# Altium schematic sheet DC_DC_Power.SchDoc
size A4; SheetNumber: 1; SheetTotal: 2
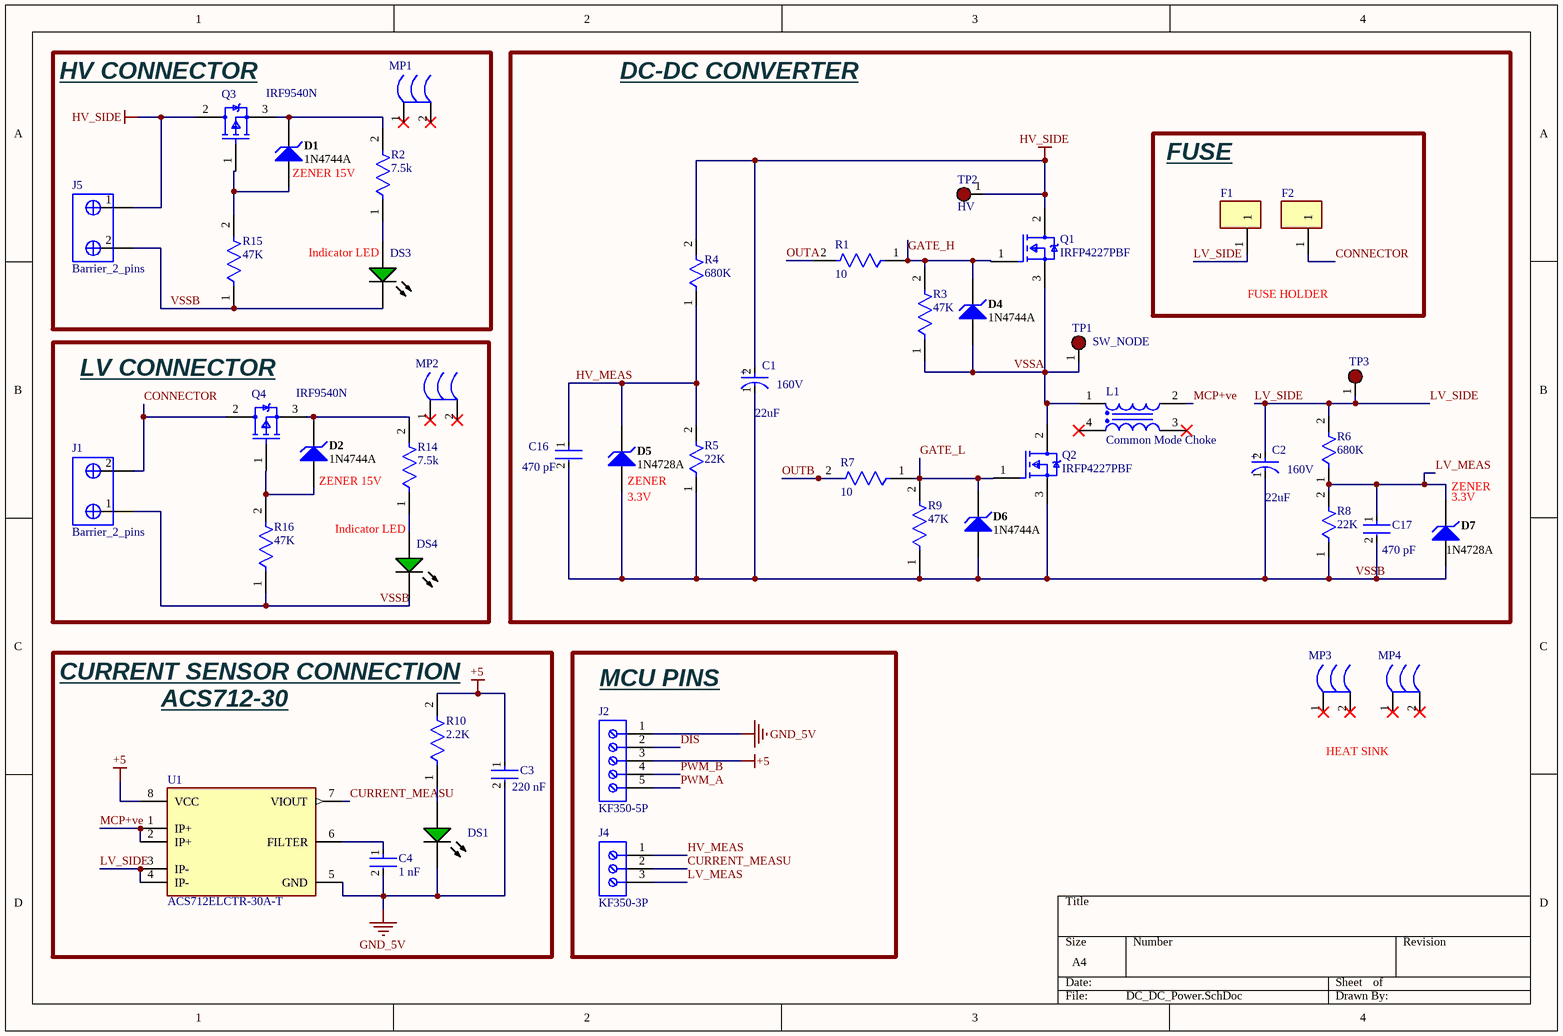
[diagram p0: DC_DC_Power.SchDoc]

## Parts
C1  22uF  [FP-RAD-TH-D_18_0_5-L_31_5-MFG]
C2  22uF  [FP-RAD-TH-D_18_0_5-L_31_5-MFG]
C3  220 nF  [FP-C0805C-DN-MFG]
C4  1 nF  [FP-C0805C-DN-MFG]
C16  470 pF  [FP-C0805C-DN-MFG]
C17  470 pF  [FP-C0805C-DN-MFG]
D1  1N4744A  [FAIR-DO-41-2_V]
D2  1N4744A  [FAIR-DO-41-2_V]
D4  1N4744A  [FAIR-DO-41-2_V]
D5  1N4728A  [FAIR-DO-41-2_V]
D6  1N4744A  [FAIR-DO-41-2_V]
D7  1N4728A  [FAIR-DO-41-2_V]
DS1  HSMG-C170  [AVAG-HSMX-C170_V]  (value not drawn)
DS3  HSMG-C170  [AVAG-HSMX-C170_V]  (value not drawn)
DS4  HSMG-C170  [AVAG-HSMX-C170_V]  (value not drawn)
F1  0751.0110  [FP-0751_0110-MFG]  (value not drawn)
F2  0751.0110  [FP-0751_0110-MFG]  (value not drawn)
J1  Barrier_2_pins  [PCBComponent_1]
J2  KF350-5P  [PCBComponent_1]
J4  KF350-3P  [PCBComponent_1]
J5  Barrier_2_pins  [PCBComponent_1]
L1  Common Mode Choke  [PCBComponent_1]
MP1  Heat Sink  [PCBComponent_1]  (value not drawn)
MP2  Heat Sink  [PCBComponent_1]  (value not drawn)
MP3  Heat Sink  [PCBComponent_1]  (value not drawn)
MP4  Heat Sink  [PCBComponent_1]  (value not drawn)
Q1  IRFP4227PBF  [FP-PG-TO247-3-MFG]
Q2  IRFP4227PBF  [FP-PG-TO247-3-MFG]
Q3  IRF9540N  [PCBComponent_1]
Q4  IRF9540N  [PCBComponent_1]
R1  10  [FP-RC0805-0_6-IPC_C]
R2  7.5k  [FP-RC0805-0_6-IPC_C]
R3  47K  [FP-RC0805-0_6-IPC_C]
R4  680K  [PCBComponent_1]
R5  22K  [PCBComponent_1]
R6  680K  [PCBComponent_1]
R7  10  [FP-RC0805-0_6-IPC_C]
R8  22K  [PCBComponent_1]
R9  47K  [FP-RC0805-0_6-IPC_C]
R10  2.2K  [FP-RC0805-0_6-IPC_C]
R14  7.5k  [FP-RC0805-0_6-IPC_C]
R15  47K  [FP-RC0805-0_6-IPC_C]
R16  47K  [FP-RC0805-0_6-IPC_C]
TP1  SW_NODE  [PCBComponent_1]
TP2  HV  [PCBComponent_1]
TP3  LV  [PCBComponent_1]  (value not drawn)
U1  ACS712ELCTR-30A-T  [FP-LC-8-IPC_C]

## Blocks framed on the sheet
HV CONNECTOR: D1 DS3 J5 MP1 Q3 R2 R15
DC-DC CONVERTER: C1 C2 C16 C17 D4-D7 L1 Q1 Q2 R1 R3-R9 TP1-TP3
FUSE: F1 F2
LV CONNECTOR: D2 DS4 J1 MP2 Q4 R14 R16
MCU PINS: J2 J4

## Nets
+5: C3.1 J2.3 R10.2 U1.8(VCC)
GND_5V: C3.2 C4.2 DS1.2(K) J2.1 U1.5(GND)
HV_SIDE: C1.2(A) J5.1 Q1.2(DRAIN) Q3.2(Drain) R4.2 TP2.1
CONNECTOR: F2.1 J1.2 Q4.2(Drain)
CURRENT_MEASU: J4.2 U1.7(VIOUT)
DIS: J2.2
GATE_H: D4.2(K) Q1.1(GATE) R1.1 R3.2
GATE_L: D6.2(K) Q2.1(GATE) R7.1 R9.2
HV_MEAS: C16.1 D5.2(K) J4.1 R4.1 R5.2
LV_MEAS: C17.1 D7.2(K) J4.3 R6.1 R8.2
LV_SIDE: C2.2(A) F1.1 R6.2 TP3.1 U1.3(IP-) U1.4(IP-)
MCP+ve: L1.2 U1.1(IP+) U1.2(IP+)
OUTA: R1.2
OUTB: R7.2
PWM_A: J2.5
PWM_B: J2.4
VSSA: D4.1(A) L1.1 Q1.3(SOURCE) Q2.2(DRAIN) R3.1 TP1.1
VSSB: C1.1(C) C2.1(C) C16.2 C17.2 D5.1(A) D6.1(A) D7.1(A) DS3.2(K) DS4.2(K) J1.1 J5.2 Q2.3(SOURCE) R5.1 R8.1 R9.1 R15.1 R16.1
NetC4_1: C4.1 U1.6(FILTER)
NetD1_1: D1.1(A) Q3.1(Gate) R15.2
NetD1_2: D1.2(K) Q3.3(Source) R2.2
NetD2_1: D2.1(A) Q4.1(Gate) R16.2
NetD2_2: D2.2(K) Q4.3(Source) R14.2
NetDS1_1: DS1.1(A) R10.1
NetDS3_1: DS3.1(A) R2.1
NetDS4_1: DS4.1(A) R14.1

Not connected (* = marked no-connect by the designer): L1 3* 4(2)*; MP1 1* 2*; MP2 1* 2*; MP3 1* 2*; MP4 1* 2*

## Notes on the sheet
- (near D1) ZENER 15V
- (near DS3) Indicator LED
- FUSE HOLDER
- (near D2) ZENER 15V
- (near D5) ZENER
- (near D5) 3.3V
- (near D7) ZENER
- (near D7) 3.3V
- Indicator LED
- CURRENT SENSOR CONNECTION
- ACS712-30
- HEAT SINK
- (in symbol CMP-05427-000720-1) +

## Library data of the parts
C1 C2 = CMP-05427-000720-1: Aluminum Electrolytic Capacitors (Radial Lead Type) 330uF ±20% 160V; Dissipation Factor: 0.15%; Leakage Current: 3.178mA; Lead Diameter: 0.8mm; Ripple Current (AC): 2.6A; Life (Hours): 10000Hour; Polarity: Polar; Min Operating Temperature: -25°C; Mount: Through Hole; Radiation Hardening: No; Max Operating Temperature: 105°C; Construction: RADIAL; Lead Free: Lead Free; RoHS Compliant: Yes; Voltage Rating: 160V; Contact Plating: Tin; Voltage Rating (DC): 160V; Lead Pitch: 7.5mm; Tolerance: 20%; Packaging: Bulk; Length: 31.5mm; Case/Package: Radial; Height: 31.5mm; Diameter: 18mm; Capacitance: 330uF; Weight: 0.01lb; REACH SVHC: No SVHC; Height - Seated (Max): 1.319inch; Number of Pins: 2; Termination: Radial; Ripple Current: 2.6A; Package Quantity: 50; Series: EE; Width: 0.5inch; Voltage: 160V
C3 C4 C16 C17 = CMP-1036-04552-2: CAP CER 0.22UF 50V X7R 0805; Manufacturer: KEMET; Manufacturer Part Number: C0805C224K5RACTU; Value: 0.22 μF; Temperature Coefficient: 30ppm/°C; Material: Ceramic; Tolerance: 0.1; ComponentLink2URL: https://content.kemet.com/datasheets/KEM_C1003_C0G_SMD.pdf; Temperature Characteristic: X7R; Device Class L3: Ceramic Capacitors; Lead Free: Yes; Temperature: -55°C to +125°C; RoHS: TRUE; Capacitance: 0.22 μF; Automotive: No; Octopart: https://octopart.com/c0805c224k5ractu-kemet-144670; Temperature Range Low: -55°C; Height: 0.88mm; Device Class L1: Passive Components; Digikey Description: CAP CER 0.22UF 50V X7R 0805; ComponentLink2Description: Datasheet; Mouser Description: CAP CER 0.22UF 50V X7R 0805; Category: Cap; Ipc Land Pattern Name: CAPC200125X78; Temperature Range High: +125°C; Package: C0805C-DN; Device Class L2: Capacitors; Voltage Rating: 50 V
D1 D2 D4 D6 = CMP-0892-00005-1: Zener Diode, 15V, 1W, 5%, -65 to 200 degC, 2-Pin DO-41, Body 2.72 x 5.2 mm, RoHS; Manufacturer: Fairchild Semiconductor; Test Current IZ (mA): 17; PD (W): 1; IR (uA): 5; VZ (Min.) (V): 14.25; VZ (Max.) (V): 15.75; ZZ (Max) (ohm): 10; PackageReference: DO-41-2; ComponentLink1URL: http://www.fairchildsemi.com/; ComponentLink2URL: http://www.fairchildsemi.com/ds/1N/1N4744A.pdf; ComponentLink3Description: Package Specification; PackageDescription: 2-Pin Axial leaded, Body 2.72 x 5.2 mm, Lead Spread 25.4 mm; ComponentLink2Description: Datasheet; PackageVersion: Rev. 2; ComponentLink3URL: http://www.fairchildsemi.com/dwg/DO/DO41A.pdf; Operating and Storage Temperature Range: -65 to 200 degC; PartNumber: 1N4744A; ComponentLink1Description: Manufacturer URL; DatasheetVersion: Rev. H3; RoHS: TRUE; Tolerance: 5%; Mounting Technology: Through Hole
D5 D7 = CMP-0892-00028-1: Zener Diode, 3.3V, 1W, 5%, -65 to 200 degC, 2-Pin DO-41, Body 2.72 x 5.2 mm, RoHS; Manufacturer: Fairchild Semiconductor; PD (W): 1; VZ (Max.) (V): 3.465; IR (uA): 100; ZZ (Max) (ohm): 10; Test Current IZ (mA): 76; VZ (Min.) (V): 3.135; DatasheetVersion: Rev. H3; Tolerance: 5%; ComponentLink3URL: http://www.fairchildsemi.com/dwg/DO/DO41A.pdf; ComponentLink2Description: Datasheet; PackageDescription: 2-Pin Axial leaded, Body 2.72 x 5.2 mm, Lead Spread 25.4 mm; PartNumber: 1N4728A; Operating and Storage Temperature Range: -65 to 200 degC; Mounting Technology: Through Hole; ComponentLink3Description: Package Specification; PackageReference: DO-41-2; ComponentLink1URL: http://www.fairchildsemi.com/; RoHS: TRUE; ComponentLink1Description: Manufacturer URL; ComponentLink2URL: http://www.fairchildsemi.com/ds/1N/1N4744A.pdf; PackageVersion: Rev. 2
DS1 DS3 DS4 = CMP-2000-05062-1: Chip LED, Green, 2.2 V, -40 to 85 degC, 2-Pin SMD, Pb-Free, Tape and Reel; Manufacturer: Avago; No. of Pins: 2; Peak Wavelength: 570nm; SVHC: NoSVHC(16-Jun-2014); Dominant Wavelength: 572nm; Forward Current If: 20mA; Viewing Angle: 170deg; Lens Shape: Rectangular; PIV Max: 5V; External Width: 1.25mm; LED Type: Standard; External Depth: 0.8mm; Opto Mounting Orientation: Top; Luminous Intensity: 15mcd; Luminous Intensity Min: 4mcd; Forward Voltage VF Max: 2.6V; External Length / Height: 2mm; Bulb Size: 1.25mmx1.4mm; Light Area Height: 1mm; Voltage Vf Typ: 2.2V; Operating Temperature Max: 85degC; Datasheet Version: Oct-08; MSL: MSL2A-4weeks; Peak Forward Current: 20mA; Package Description: 2-Pin Surface Mount Device, Body 2 x 1.25 mm, Height 0.8 mm; Datasheet URL: https://datasheet.ciiva.com/29280/180495-da-01-en-chip-led-hsmg-c170-gelb-gruen-29280971.pdf; Storage Temperature Min: -40degC; LED Colour: Green; Wavelength Typ: 570nm; Mounting Type: SMD; Forward Current If Max: 20mA; Dominant Wavelength Typ: 572nm; LED Mounting: SMD; Operating Temperature Range: -30degCto+85degC; Operating Temperature Min: -30degC; Manufacturer URL: http://www.avagotech.com/; Packaging: CutTape; Luminous Intensity Typ: 15mcd; Package Reference: HSMX-C170; Storage Temperature Max: 85degC; Opto Case Style: SMD; Forward Voltage: 2.2V
F1 F2 = CMP-26292-000006-1: FUSE CLIP CARTRIDGE 10A PCB; Manufacturer: Schurter; Conn Orientation: Horizontal; Voltage Rating Ac: 500V; Number Of Fuses: 1; ComponentLink2Description: Datasheet; ComponentLink2URL: https://us.schurter.com/bundles/snceschurter/epim/_ProdPool_/newDS/en/typ_OG__Clip__5x20.pdf; Package: 0; Device Class L1: Circuit Protection; Lead Free: Yes; RoHS: TRUE; Voltage Rating Dc: 500V; Device Class L3: unset; Ambient Temperature Range Low: -40°C; Manufacturer Part Number: 0751.0110; Device Class L2: Fuse Holders; Octopart: https://octopart.com/0751.0110-schurter-19402; Height: 8.9mm; Digikey Description: FUSE CLIP CARTRIDGE 10A PCB; Ambient Temperature Range High: +85°C; Category: Fuse; Fuse Current: 10A; Automotive: No
L1 = T60405-R6123-X425: Datasheet: https://eu.mouser.com/datasheet/2/599/6123-X425-240794.pdf
Q1 Q2 = CMP-32901-000878-1: MOSFET N-CH 200V 65A TO247AC; Rds On Max: 25mR; Element Configuration: Single; Turn-On Delay Time: 33ns; Threshold Voltage: 5V; Input Capacitance: 4.6nF; Max Power Dissipation: 330W; Gate to Source Voltage (Vgs): 30V; Lead Free: Lead Free; Packaging: Rail/Tube; Case/Package: TO-247; Series: HEXFET®; Length: 0.625inch; Max Operating Temperature: 175°C; REACH SVHC: No SVHC; Contact Plating: Tin; RoHS Compliant: Yes; Continuous Drain Current (ID): 65A; Drain to Source Voltage (Vdss): 200V; Height: 0.815inch; Max Dual Supply Voltage: 200V; Halogen Free: Not Halogen Free; Width: 0.209inch; Power Dissipation: 330W; Mount: Through Hole; Number of Pins: 3; Min Operating Temperature: -40°C
R1 R7 = CMP-2100-03668-5: 33  1/8W   0805; Power Rating: 125mW; Temperature Coefficient: 100ppm/°C; Tolerance: 1%; Voltage Rating (DC): 150V; Resistance: 100kR; Package Quantity: 1; Case/Package: 0805; Lead Pitch: 0.4mm; Case Code (Imperial): 0805; Construction: Rectangular; Number of Terminations: 2; RoHS Compliant: Yes; Max Power Dissipation: 125mW; Max Operating Temperature: 155°C; Resistance Tolerance: 1%; Lead Free: Lead Free; Packaging: Tape and Reel; Resistor Type: Thick Film; Min Operating Temperature: -55°C; Case Code (Metric): 2012; Series: RC; Technology: THICK FILM; Voltage Rating: 150V; Termination: SMD/SMT; Width: 0.049inch; Number of Pins: 2; Features: Moisture Resistant; Military Standard: Not; Length: 0.079inch; Depth: 1.25mm; Size Code: 0805; Height: 0.024inch
R2 R14 = CMP-2100-03668-5: 7.5K  1/8W   0805; Power Rating: 125mW; Temperature Coefficient: 100ppm/°C; Tolerance: 1%; Voltage Rating (DC): 150V; Resistance: 100kR; Package Quantity: 1; Case/Package: 0805; Lead Pitch: 0.4mm; Case Code (Imperial): 0805; Construction: Rectangular; Number of Terminations: 2; RoHS Compliant: Yes; Max Power Dissipation: 125mW; Max Operating Temperature: 155°C; Resistance Tolerance: 1%; Lead Free: Lead Free; Packaging: Tape and Reel; Resistor Type: Thick Film; Min Operating Temperature: -55°C; Case Code (Metric): 2012; Series: RC; Technology: THICK FILM; Voltage Rating: 150V; Termination: SMD/SMT; Width: 0.049inch; Number of Pins: 2; Features: Moisture Resistant; Military Standard: Not; Length: 0.079inch; Depth: 1.25mm; Size Code: 0805; Height: 0.024inch
R3 R9 R15 R16 = CMP-2100-03668-5: 47K  1/8W   0805; Power Rating: 125mW; Temperature Coefficient: 100ppm/°C; Tolerance: 1%; Voltage Rating (DC): 150V; Resistance: 100kR; Package Quantity: 1; Case/Package: 0805; Lead Pitch: 0.4mm; Case Code (Imperial): 0805; Construction: Rectangular; Number of Terminations: 2; RoHS Compliant: Yes; Max Power Dissipation: 125mW; Max Operating Temperature: 155°C; Resistance Tolerance: 1%; Lead Free: Lead Free; Packaging: Tape and Reel; Resistor Type: Thick Film; Min Operating Temperature: -55°C; Case Code (Metric): 2012; Series: RC; Technology: THICK FILM; Voltage Rating: 150V; Termination: SMD/SMT; Width: 0.049inch; Number of Pins: 2; Features: Moisture Resistant; Military Standard: Not; Length: 0.079inch; Depth: 1.25mm; Size Code: 0805; Height: 0.024inch
R4-R6 R8 = RES
R10 = CMP-2100-03668-5: 2.2K  1/8W   0805; Power Rating: 125mW; Temperature Coefficient: 100ppm/°C; Tolerance: 1%; Voltage Rating (DC): 150V; Resistance: 100kR; Package Quantity: 1; Case/Package: 0805; Lead Pitch: 0.4mm; Case Code (Imperial): 0805; Construction: Rectangular; Number of Terminations: 2; RoHS Compliant: Yes; Max Power Dissipation: 125mW; Max Operating Temperature: 155°C; Resistance Tolerance: 1%; Lead Free: Lead Free; Packaging: Tape and Reel; Resistor Type: Thick Film; Min Operating Temperature: -55°C; Case Code (Metric): 2012; Series: RC; Technology: THICK FILM; Voltage Rating: 150V; Termination: SMD/SMT; Width: 0.049inch; Number of Pins: 2; Features: Moisture Resistant; Military Standard: Not; Length: 0.079inch; Depth: 1.25mm; Size Code: 0805; Height: 0.024inch
TP1-TP3 = TP: Test Point, Miniature, Red, TH
U1 = CMP-2000-04990-2: SENSOR CURRENT HALL 30A AC/DC; Bandwidth: 80kHz; Max Supply Current: 13mA; Linearity: 1.5%; Operating Supply Voltage: 5V; Quiescent Current: 10mA; Number of Channels: 1; Polarity: Bidirectional; Min Supply Voltage: 4.5V; Response Time: 5us; Sensitivity: 66mV/A; Max Supply Voltage: 5.5V; Current Sensing: 30A; REACH SVHC: No SVHC; Mount: Surface Mount; Max Operating Temperature: 85°C; Packaging: Cut Tape; Frequency: 80kHz; Series: -; Termination: SMD/SMT; RoHS Compliant: Yes; Number of Pins: 8; Package Quantity: 1; Accuracy: 1.5%; Lead Free: Lead Free; Case/Package: SOIC; Min Operating Temperature: -40°C; Output Current: 10mA